# Altium schematic sheet HVPSV3_GaN_system_5_5V_v2.SchDoc
size D; PageSetup: Record=PageOptions|CenterHorizontal=False|CenterVertical=False|PrintScale=0.75|XCorrection=0.75|YCorrection=1.00|PrintKind=0|BorderSize=5000000|LeftOffset=0|BottomOffset=1|Orientation=2|PaperLength=1000|PaperWidth=1000|Scale=100|PaperSource=7|PrintQuality=-3|MediaType=1|DitherType=10|PrintScaleMode=0|PaperKind=Letter|PaperIndex=1
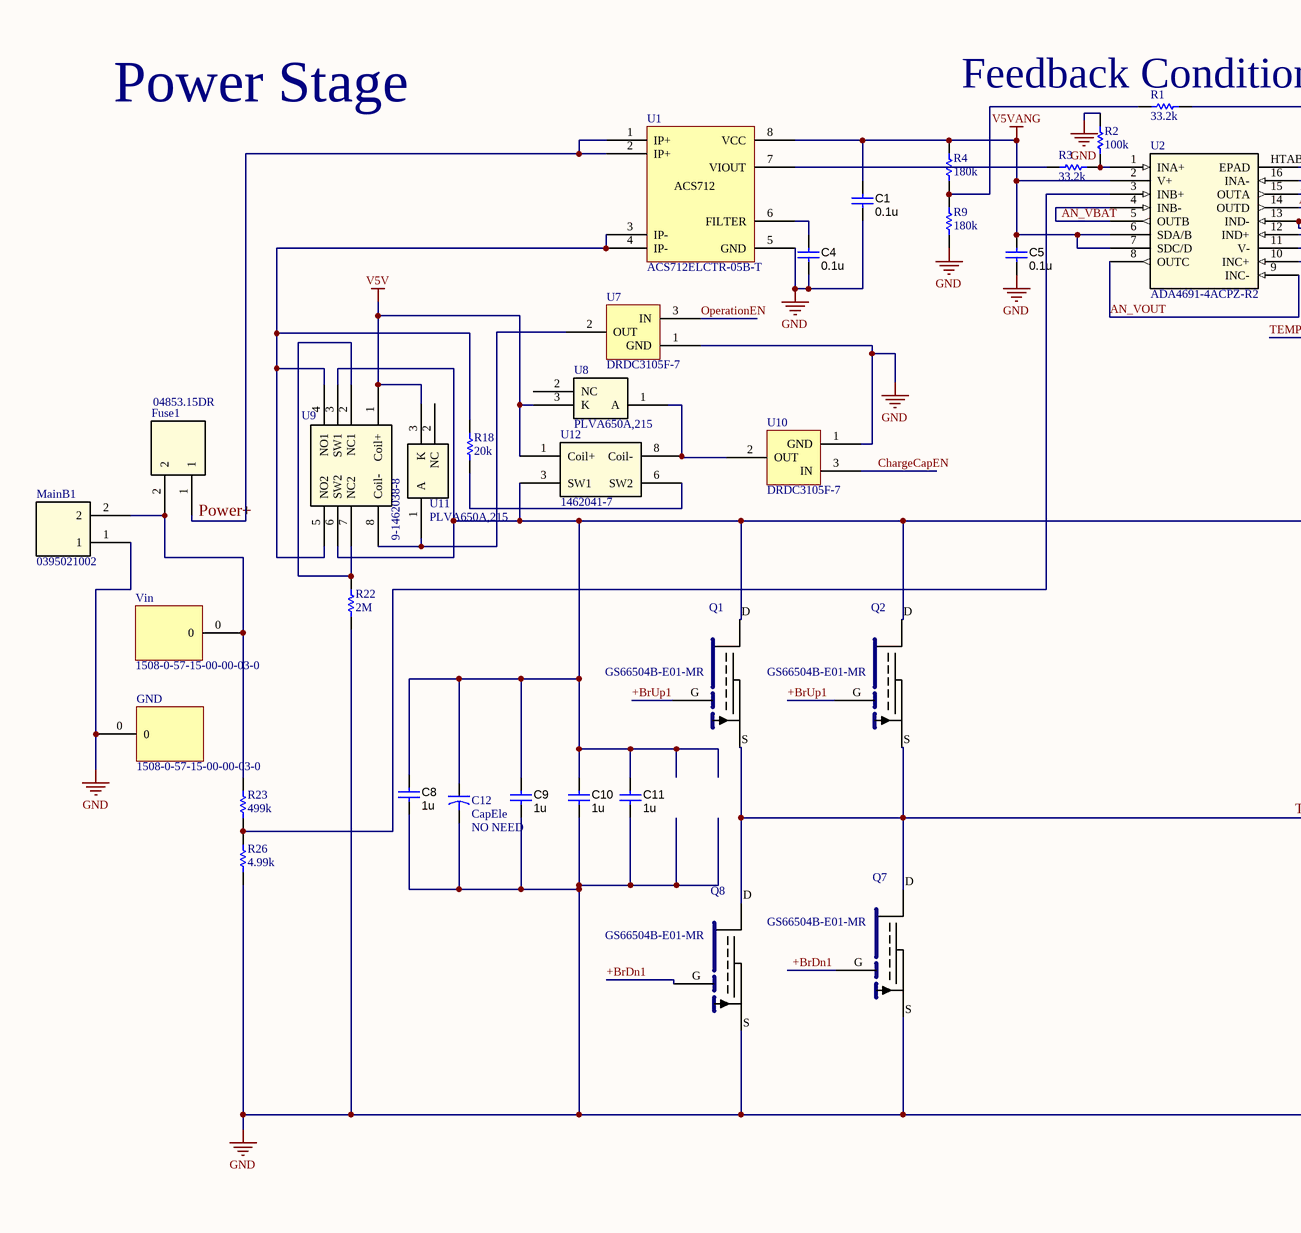
[diagram p0: HVPSV3_GaN_system_5_5V_v2.SchDoc, top left]
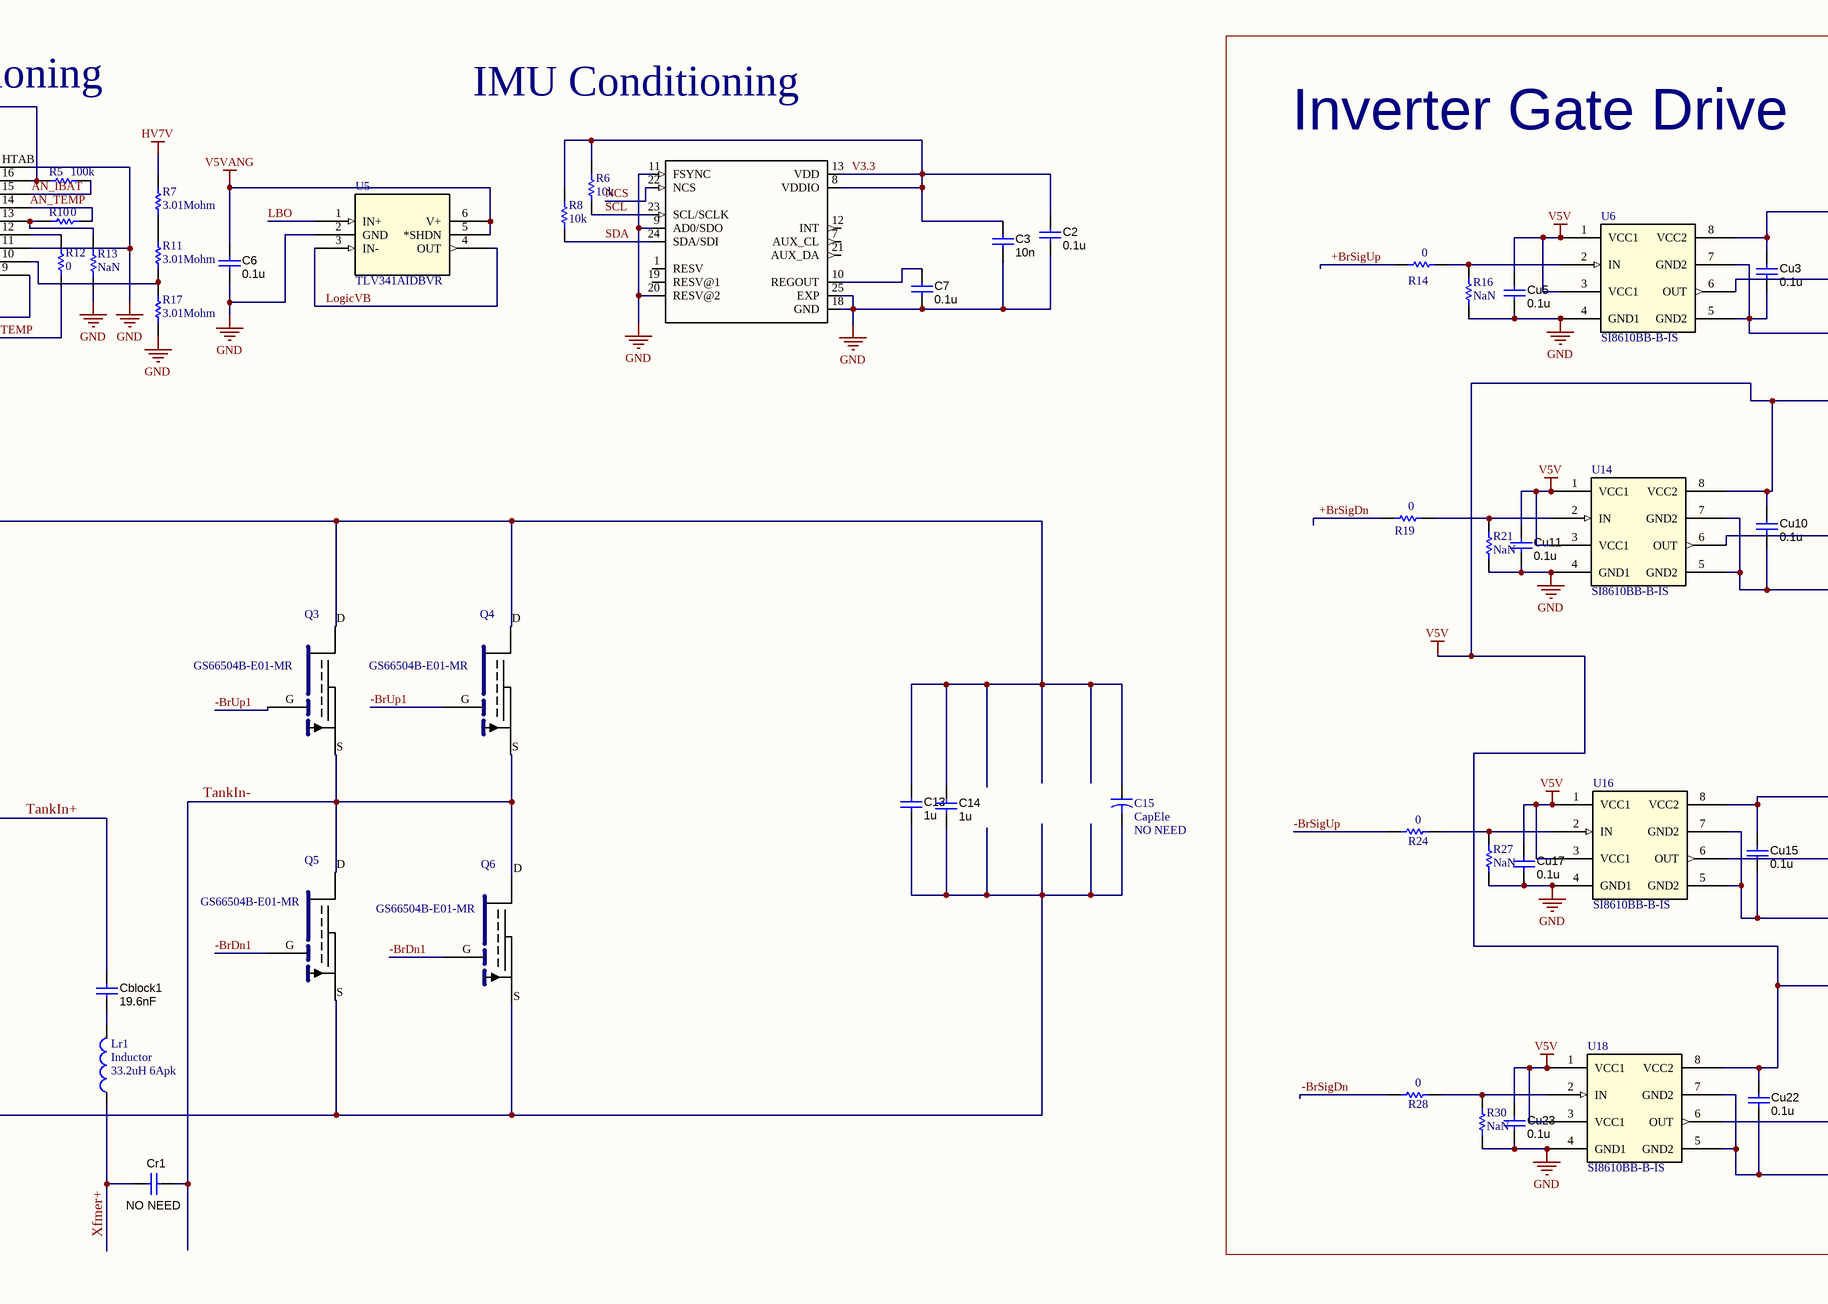
[diagram p1: HVPSV3_GaN_system_5_5V_v2.SchDoc, top middle]
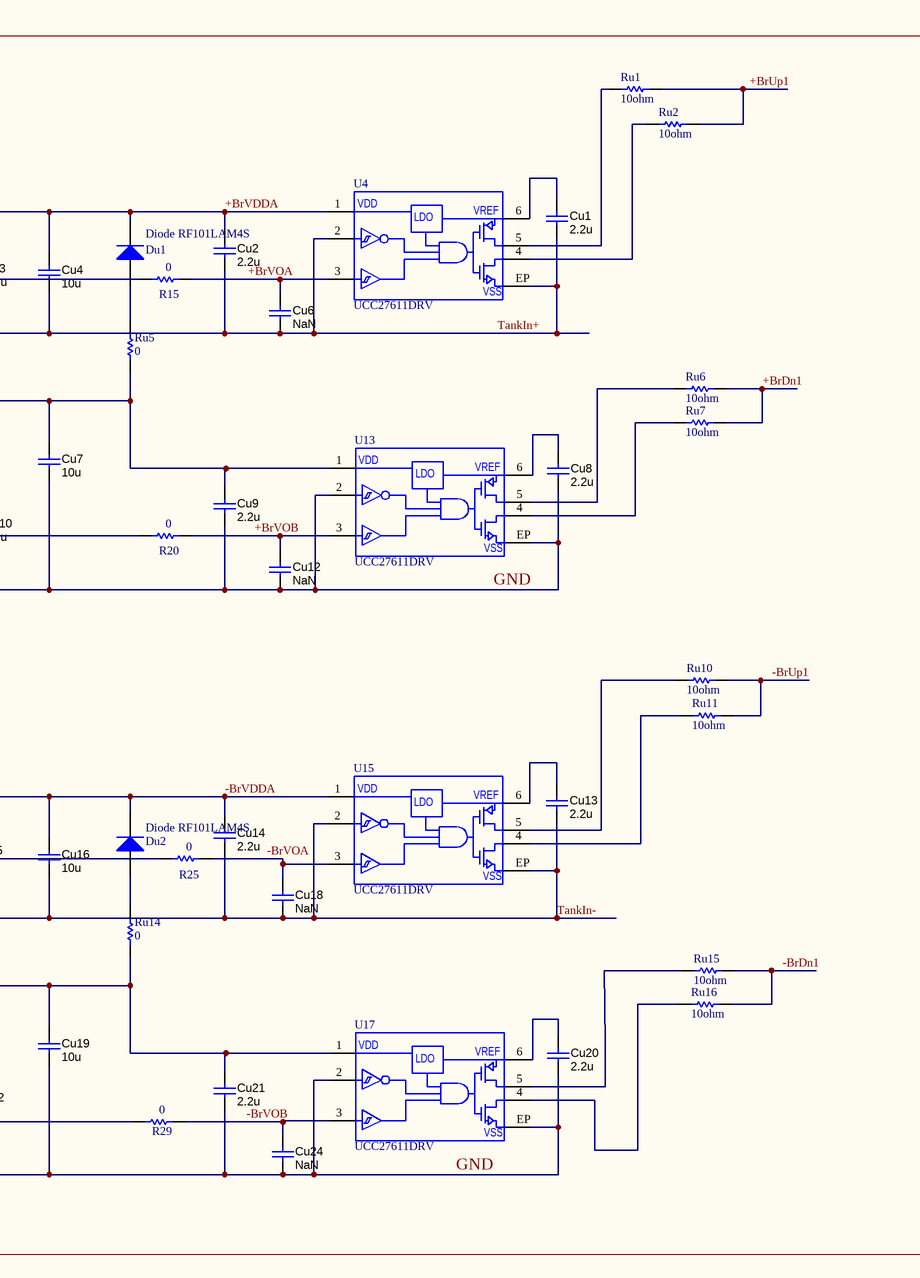
[diagram p2: HVPSV3_GaN_system_5_5V_v2.SchDoc, top right]
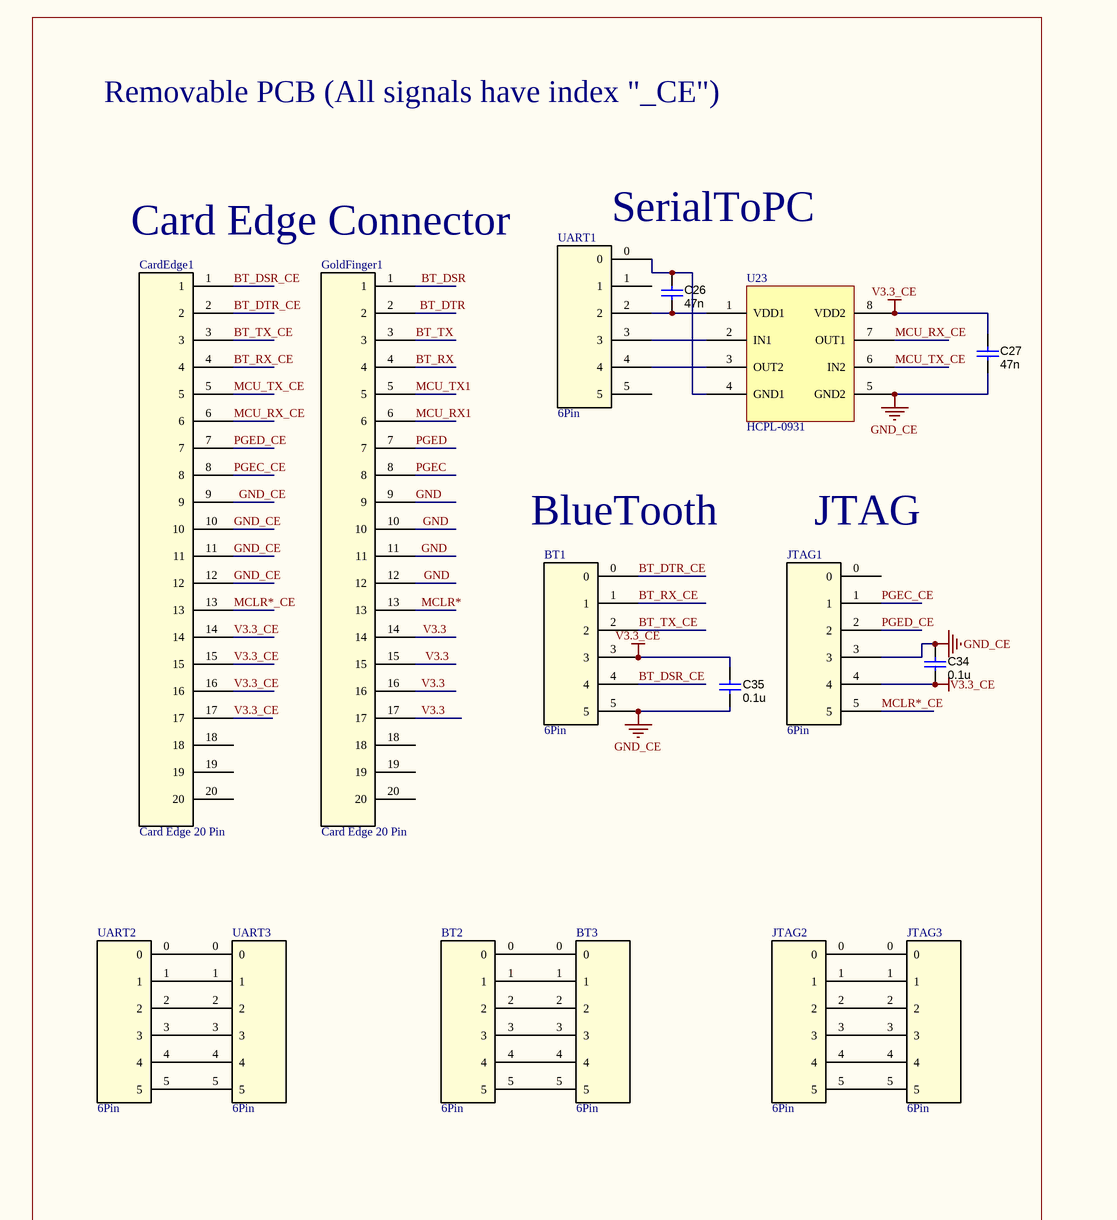
[diagram p3: HVPSV3_GaN_system_5_5V_v2.SchDoc, bottom left]
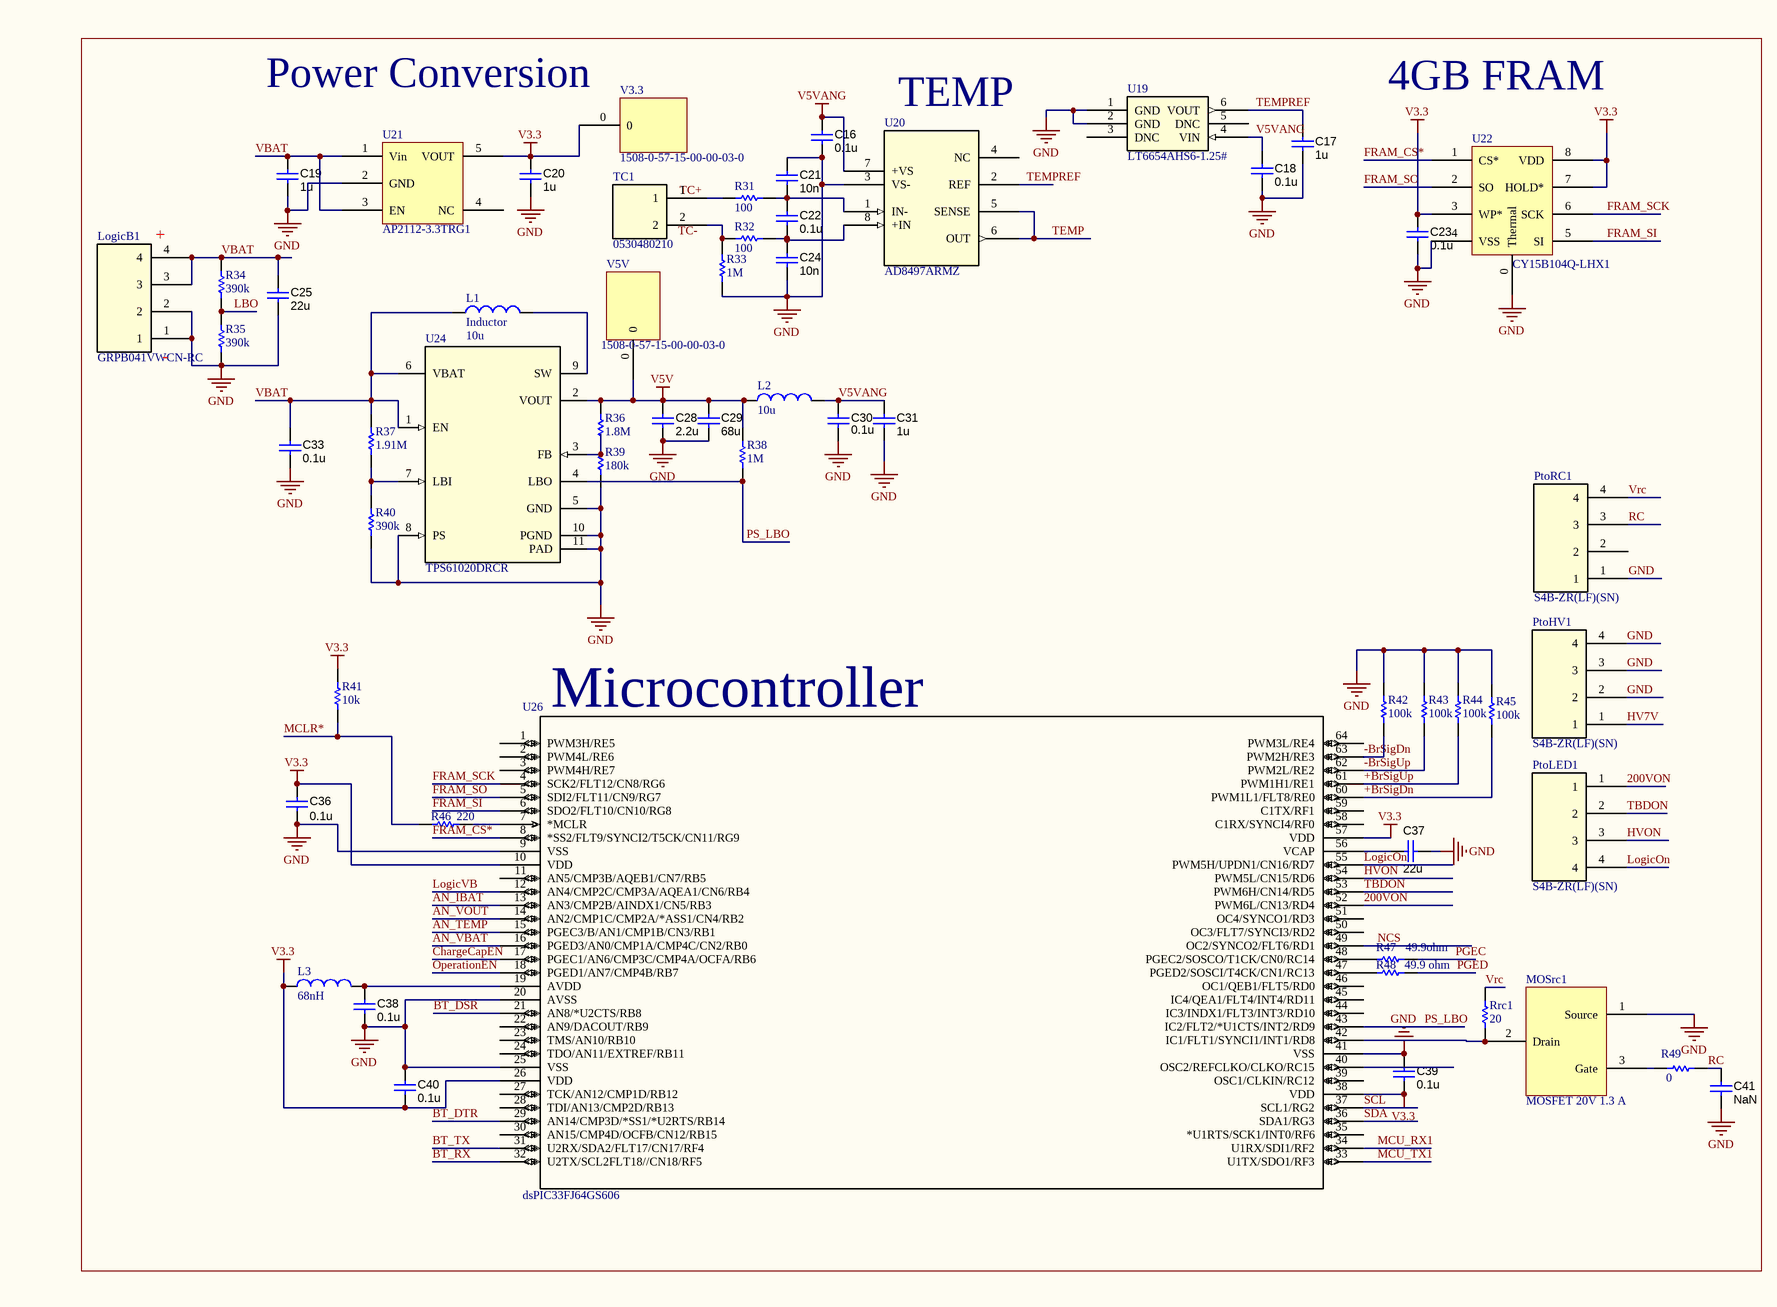
[diagram p4: HVPSV3_GaN_system_5_5V_v2.SchDoc, bottom middle]
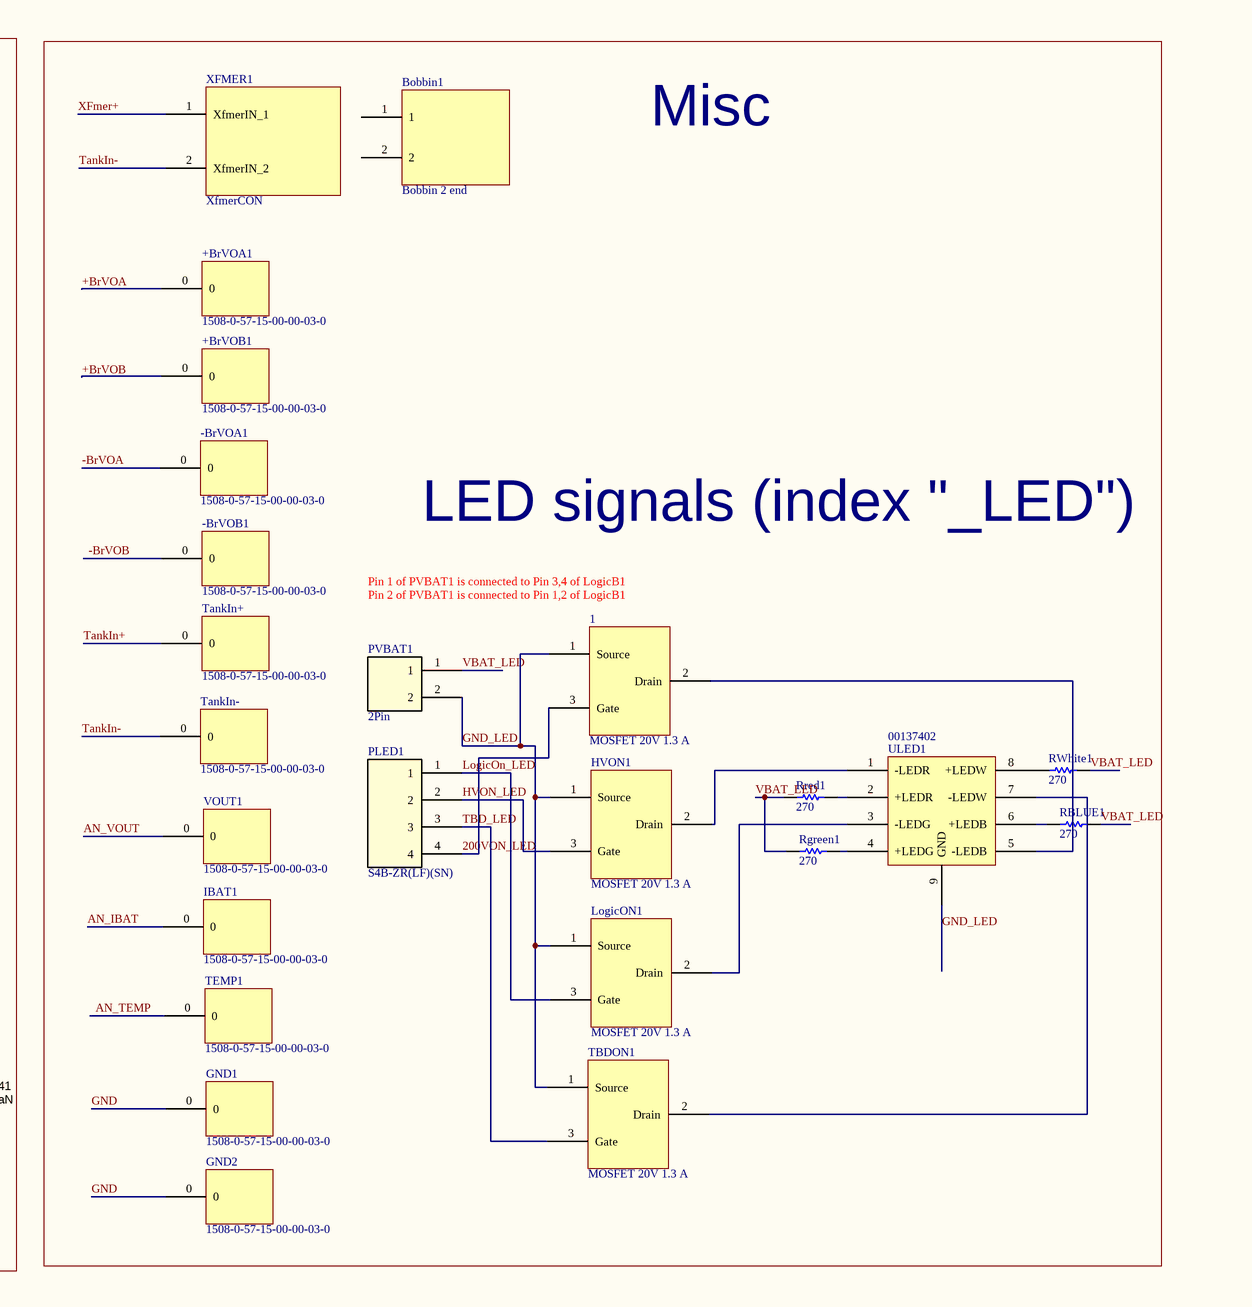
[diagram p5: HVPSV3_GaN_system_5_5V_v2.SchDoc, bottom right]

## Parts
1  MOSFET 20V 1.3 A  [SOT23 Super]
+BrVOA1  1508-0-57-15-00-00-03-0  [TestPoint-MillMaxPin]
+BrVOB1  1508-0-57-15-00-00-03-0  [TestPoint-MillMaxPin]
-BrVOA1  1508-0-57-15-00-00-03-0  [TestPoint-MillMaxPin]
-BrVOB1  1508-0-57-15-00-00-03-0  [TestPoint-MillMaxPin]
Bobbin1  Bobbin 2 end  [RM14 Bobbin - shrink]
BT1  6Pin  [S6B-ZR connector]
BT2  6Pin  [6 pin Terminal - pitch 2.54mm]
BT3  6Pin  [S6B-ZR connector]
C1  0.1u  [C1206]
C2  0.1u  [CAP0402]
C3  10n  [CAP0402]
C4  0.1u  [CAP0603]
C5  0.1u  [C1206]
C6  0.1u  [IND0805]
C7  0.1u  [CAP0402]
C8  1u  [C2220]
C9  1u  [C2220]
C10  1u  [C2220]
C11  1u  [C2220]
C12  CapEle  value NO NEED  [ElecCap - 3.5 mm space]
C13  1u  [C2220]
C14  1u  [C2220]
C15  CapEle  value NO NEED  [ElecCap - 3.5 mm space]
C16  0.1u  [CAP0603]
C17  1u  [CAP0603]
C18  0.1u  [CAP0603]
C19  1u  [CAP0402]
C20  1u  [CAP0402]
C21  10n  [CAP0402]
C22  0.1u  [CAP0402]
C23  0.1u  [IND0805]
C24  10n  [CAP0402]
C25  22u  [C1206]
C26  47n  [C1206]
C27  47n  [C1206]
C28  2.2u  [C1206]
C29  68u  [C1206]
C30  0.1u  [CAP0603]
C31  1u  [CAP0402]
C33  0.1u  [CAP0603]
C34  0.1u  [C1206]
C35  0.1u  [C1206]
C36  0.1u  [C1206]
C37  22u  [C1206]
C38  0.1u  [C1206]
C39  0.1u  [C1206]
C40  0.1u  [C1206]
C41  NaN  [CAP0603]
CardEdge1  Card Edge 20 Pin  [3MCardEdge20Pin_Connector]
Cblock1  19.6nF  [C1210]
Cr1  NO NEED  [C1210]
Cu1  2.2u  [0402]
Cu2  2.2u  [0402]
Cu3  0.1u  [CAP0402]
Cu4  10u  [CAP0603]
Cu5  0.1u  [C1206]
Cu6  NaN  [0402]
Cu7  10u  [CAP0603]
Cu8  2.2u  [0402]
Cu9  2.2u  [0402]
Cu10  0.1u  [C1206]
Cu11  0.1u  [C1206]
Cu12  NaN  [0402]
Cu13  2.2u  [0402]
Cu14  2.2u  [0402]
Cu15  0.1u  [CAP0402]
Cu16  10u  [CAP0603]
Cu17  0.1u  [C1206]
Cu18  NaN  [0402]
Cu19  10u  [CAP0603]
Cu20  2.2u  [0402]
Cu21  2.2u  [0402]
Cu22  0.1u  [C1206]
Cu23  0.1u  [C1206]
Cu24  NaN  [0402]
Du1  Diode RF101LAM4S  [SBR1U400P1]
Du2  Diode RF101LAM4S  [SBR1U400P1]
Fuse1  04853.15DR  [LittleFuse462]
GND  1508-0-57-15-00-00-03-0  [TestPoint-MillMaxPin]
GND1  1508-0-57-15-00-00-03-0  [TestPoint-MillMaxPin]
GND2  1508-0-57-15-00-00-03-0  [TestPoint-MillMaxPin]
GoldFinger1  Card Edge 20 Pin  [3MCardEdge20Pin_Board]
HVON1  MOSFET 20V 1.3 A  [SOT23 Super]
IBAT1  1508-0-57-15-00-00-03-0  [TestPoint-MillMaxPin]
JTAG1  6Pin  [S6B-ZR connector]
JTAG2  6Pin  [6 pin Terminal - pitch 2.54mm]
JTAG3  6Pin  [S6B-ZR connector]
L1  Inductor  value 10u  [SD25inductor]
L2  10u  [IND0805]
L3  68nH  [CAP0603]
LogicB1  GRPB041VWCN-RC  [4 pin Terminal - pitch 1.27mm - right angle]
LogicON1  MOSFET 20V 1.3 A  [SOT23 Super]
Lr1  Inductor  value 33.2uH 6Apk  [ExtInductor]
MainB1  0395021002  [Molex 395001002]
MOSrc1  MOSFET 20V 1.3 A  [SOT23 Super]
PLED1  S4B-ZR(LF)(SN)  [S4B-ZR connector]
PtoHV1  S4B-ZR(LF)(SN)  [S4B-ZR connector]
PtoLED1  S4B-ZR(LF)(SN)  [S4B-ZR connector]
PtoRC1  S4B-ZR(LF)(SN)  [S4B-ZR connector]
PVBAT1  2Pin  [S2B-ZR connector]
Q1  GS66504B-E01-MR  [GS66504B]
Q2  GS66504B-E01-MR  [GS66504B]
Q3  GS66504B-E01-MR  [GS66504B]
Q4  GS66504B-E01-MR  [GS66504B]
Q5  GS66504B-E01-MR  [GS66504B]
Q6  GS66504B-E01-MR  [GS66504B]
Q7  GS66504B-E01-MR  [GS66504B]
Q8  GS66504B-E01-MR  [GS66504B]
R1  value 33.2k  [RES0402]  (hidden comment: Res)
R2  value 100k  [RES0402]  (hidden comment: Res)
R3  value 33.2k  [RES0402]  (hidden comment: Res)
R4  value 180k  [RES0402]  (hidden comment: Res)
R5  value 100k  [RES0402]  (hidden comment: Res)
R6  value 10k  [RES0402]  (hidden comment: Res)
R7  value 3.01Mohm  [C1210]  (hidden comment: Res)
R8  value 10k  [RES0402]  (hidden comment: Res)
R9  value 180k  [RES0402]  (hidden comment: Res)
R10  value 0  [RES0402]  (hidden comment: Res)
R11  value 3.01Mohm  [C1210]  (hidden comment: Res)
R12  value 0  [RES0402]  (hidden comment: Res)
R13  value NaN  [RES0402]  (hidden comment: Res)
R14  value 0  [RES0402]  (hidden comment: Res)
R15  value 0  [RES0402]  (hidden comment: Res)
R16  value NaN  [RES0402]  (hidden comment: Res)
R17  value 3.01Mohm  [C1210]  (hidden comment: Res)
R18  value 20k  [IND0805]  (hidden comment: Res)
R19  value 0  [RES0402]  (hidden comment: Res)
R20  value 0  [RES0402]  (hidden comment: Res)
R21  value NaN  [RES0402]  (hidden comment: Res)
R22  value 2M  [C1210]  (hidden comment: Res)
R23  value 499k  [IND0805]  (hidden comment: Res)
R24  value 0  [RES0402]  (hidden comment: Res)
R25  value 0  [RES0402]  (hidden comment: Res)
R26  value 4.99k  [RES0603]  (hidden comment: Res)
R27  value NaN  [RES0402]  (hidden comment: Res)
R28  value 0  [RES0402]  (hidden comment: Res)
R29  value 0  [RES0402]  (hidden comment: Res)
R30  value NaN  [RES0402]  (hidden comment: Res)
R31  value 100  [RES0402]  (hidden comment: Res)
R32  value 100  [RES0402]  (hidden comment: Res)
R33  value 1M  [RES0402]  (hidden comment: Res)
R34  value 390k  [RES0402]  (hidden comment: Res)
R35  value 390k  [RES0402]  (hidden comment: Res)
R36  value 1.8M  [RES0402]  (hidden comment: Res)
R37  value 1.91M  [RES0402]  (hidden comment: Res)
R38  value 1M  [RES0402]  (hidden comment: Res)
R39  value 180k  [RES0603]  (hidden comment: Res)
R40  value 390k  [RES0402]  (hidden comment: Res)
R41  value 10k  [RES0402]  (hidden comment: Res)
R42  value 100k  [RES0402]  (hidden comment: Res)
R43  value 100k  [RES0402]  (hidden comment: Res)
R44  value 100k  [RES0402]  (hidden comment: Res)
R45  value 100k  [RES0402]  (hidden comment: Res)
R46  value 220  [RES0402]  (hidden comment: Res)
R47  value 49.9ohm  [RES0402]  (hidden comment: Res)
R48  value 49.9 ohm  [RES0402]  (hidden comment: Res)
R49  value 0  [RES0603]  (hidden comment: Res)
RBLUE1  value 270  [RES0603]  (hidden comment: Res)
Rgreen1  value 270  [RES0603]  (hidden comment: Res)
Rrc1  value 20  [RES0603]  (hidden comment: Res)
Rred1  value 270  [RES0603]  (hidden comment: Res)
Ru1  value 10ohm  [0402]  (hidden comment: Res)
Ru2  value 10ohm  [0402]  (hidden comment: Res)
Ru5  value 0  [IND0805]  (hidden comment: Res)
Ru6  value 10ohm  [0402]  (hidden comment: Res)
Ru7  value 10ohm  [0402]  (hidden comment: Res)
Ru10  value 10ohm  [0402]  (hidden comment: Res)
Ru11  value 10ohm  [0402]  (hidden comment: Res)
Ru14  value 0  [IND0805]  (hidden comment: Res)
Ru15  value 10ohm  [0402]  (hidden comment: Res)
Ru16  value 10ohm  [0402]  (hidden comment: Res)
RWhite1  value 270  [RES0603]  (hidden comment: Res)
TankIn+  1508-0-57-15-00-00-03-0  [TestPoint-MillMaxPin]
TankIn-  1508-0-57-15-00-00-03-0  [TestPoint-MillMaxPin]
TBDON1  MOSFET 20V 1.3 A  [SOT23 Super]
TC1  0530480210  [2 pin Terminal - pitch 1.27mm - right angle]
TEMP1  1508-0-57-15-00-00-03-0  [TestPoint-MillMaxPin]
U1  ACS712ELCTR-05B-T  [SOIC-8]
U2  ADA4691-4ACPZ-R2  [CP_16_22]
U3  MPU-9250  [QFN40P300X300X105-25N]  (value not drawn)
U4  UCC27611DRV  [WSON-N6]
U5  TLV341AIDBVR  [DBV6]
U6  SI8610BB-B-IS  [D8]
U7  DRDC3105F-7  [SOT23]
U8  PLVA650A,215  [SOT23 - ZenerDiode]
U9  9-1462038-8  [GullWing8Pin]
U10  DRDC3105F-7  [SOT23]
U11  PLVA650A,215  [SOT23 - ZenerDiode]
U12  1462041-7  [GullWing4Pin]
U13  UCC27611DRV  [WSON-N6]
U14  SI8610BB-B-IS  [D8]
U15  UCC27611DRV  [WSON-N6]
U16  SI8610BB-B-IS  [D8]
U17  UCC27611DRV  [WSON-N6]
U18  SI8610BB-B-IS  [D8]
U19  LT6654AHS6-1.25#  [TSOT-23_S6]
U20  AD8497ARMZ  [RM_8]
U21  AP2112-3.3TRG1  [SOT23-5]
U22  CY15B104Q-LHX1  [DFN-8pin]
U23  HCPL-0931  [SOIC-8]
U24  TPS61020DRCR  [DRC0010A]
U26  dsPIC33FJ64GS606  [TQFP64_10x10MC]
UART1  6Pin  [S6B-ZR connector]
UART2  6Pin  [6 pin Terminal - pitch 2.54mm]
UART3  6Pin  [S6B-ZR connector]
ULED1  00137402  [LED00137402]
V3.3  1508-0-57-15-00-00-03-0  [TestPoint-MillMaxPin]
V5V  1508-0-57-15-00-00-03-0  [TestPoint-MillMaxPin]
Vin  1508-0-57-15-00-00-03-0  [TestPoint-MillMaxPin]
VOUT1  1508-0-57-15-00-00-03-0  [TestPoint-MillMaxPin]
XFMER1  XfmerCON  [ExtInductor]

## Blocks framed on the sheet
Inverter Gate Drive: Cu1-Cu24 Du1 Du2 R14-R16 R19-R21 R24 R25 R27-R30 Ru1 Ru2 Ru5-Ru7 Ru10 Ru11 Ru14-Ru16 U4 U6 U13-U18
Microcontroller: C16-C25 C28-C31 C33 C36-C41 L1-L3 LogicB1 MOSrc1 PtoHV1 PtoLED1 PtoRC1 R31-R49 Rrc1 TC1 U19-U22 U24 U26 V3.3 V5V

## Nets
GND: C1.2 C2.2 C3.2 C4.2 C5.2 C6.2 C7.2 C8.2 C9.2 C10.2 C11.2 C12.2 C13.2 C14.2 C15.2 C16.2 C17.2 C18.2 C19.2 C20.2 C21.1 C23.2 C24.2 C25.2 C28.2 C29.2 C30.2 C31.2 C33.2 C36.2 C37.2 C38.2 C39.1 C40.1 C41.2 Cu5.2 Cu7.2 Cu8.2 Cu9.2 Cu10.2 Cu11.2 Cu12.2 Cu17.2 Cu19.2 Cu20.2 Cu21.2 Cu22.2 Cu23.2 Cu24.2 GND.0 GND1.0 GND2.0 GoldFinger1.9 GoldFinger1.10 GoldFinger1.11 GoldFinger1.12 LogicB1.1 LogicB1.2 MainB1.1 MOSrc1.1(Source) PtoHV1.2 PtoHV1.3 PtoHV1.4 PtoRC1.1 Q5.S Q6.S Q7.S Q8.S R2.2 R9.1 R13.1 R16.1 R17.1 R21.1 R22.1 R26.1 R27.1 R30.1 R33.1 R35.1 R39.1 R40.1 R42.2 R43.2 R44.2 R45.2 U1.5(GND) U2.11(V-) U2.HTAB(EPAD) U3.9(AD0/SDO) U3.11(FSYNC) U3.18(GND) U3.20(RESV@2) U3.25(EXP) U5.2(GND) U6.4(GND1) U7.1(GND) U10.1(GND) U13.2(INB) U13.EP(VSS) U14.4(GND1) U14.5(GND2) U14.7(GND2) U16.4(GND1) U17.2(INB) U17.EP(VSS) U18.4(GND1) U18.5(GND2) U18.7(GND2) U19.1(GND) U19.2(GND) U20.3(VS-) U21.2(GND) U22.0(Thermal) U22.4(VSS) U24.5(GND) U24.8(PS) U24.10(PGND) U24.11(PAD) U26.9(VSS) U26.20(AVSS) U26.25(VSS) U26.41(VSS)
GND_CE: BT1.5 C27.2 C34.1 C35.2 CardEdge1.9 CardEdge1.10 CardEdge1.11 CardEdge1.12 JTAG1.3 U23.5(GND2)
HV7V: PtoHV1.1 R7.2
V3.3: C2.1 C3.1 C20.1 C23.1 C36.1 C39.2 C40.2 GoldFinger1.14 GoldFinger1.15 GoldFinger1.16 GoldFinger1.17 L3.1 R6.2 R8.2 R41.2 U3.8(VDDIO) U3.13(VDD) U21.5(VOUT) U22.3(WP*) U22.7(HOLD*) U22.8(VDD) U26.10(VDD) U26.26(VDD) U26.38(VDD) U26.57(VDD) V3.3.0
V3.3_CE: BT1.3 C27.1 C34.2 C35.1 CardEdge1.14 CardEdge1.15 CardEdge1.16 CardEdge1.17 JTAG1.4 U23.8(VDD2)
V5V: C28.1 C29.1 Cu5.1 Cu7.1 Cu9.1 Cu10.1 Cu11.1 Cu17.1 Cu19.1 Cu21.1 Cu22.1 Cu23.1 L2.1 R36.2 R38.2 Ru5.1 Ru14.1 U6.1(VCC1) U6.3(VCC1) U8.3(K) U9.1(Coil+) U11.3(K) U12.1(Coil+) U13.1(VDD) U14.1(VCC1) U14.3(VCC1) U14.8(VCC2) U16.1(VCC1) U16.3(VCC1) U17.1(VDD) U18.1(VCC1) U18.3(VCC1) U18.8(VCC2) U24.2(VOUT) V5V.0
V5VANG: C1.1 C5.1 C6.1 C16.1 C18.1 C30.1 C31.1 L2.2 R4.2 U1.8(VCC) U2.2(V+) U2.6(SDA/B) U2.7(SDC/D) U5.5(*SHDN) U5.6(V+) U19.4(VIN) U20.7(+VS)
200VON: PtoLED1.1 U26.52(PWM6L/CN13/RD4)
200VON_LED: 1.3(Gate) PLED1.4
+BrDn1: Q7.G Q8.G Ru6.2 Ru7.2
+BrSigDn: R19.1 R45.1 U26.60(PWM1L1/FLT8/RE0)
+BrSigUp: R14.1 R44.1 U26.61(PWM1H1/RE1)
+BrUp1: Q1.G Q2.G Ru1.2 Ru2.2
+BrVDDA: Cu2.1 Cu3.1 Cu4.1 Du1.K U4.1(VDD) U6.8(VCC2)
+BrVOA: +BrVOA1.0 Cu6.1 R15.2 U4.3(IN)
+BrVOB: +BrVOB1.0 Cu12.1 R20.2 U13.3(IN)
-BrDn1: Q5.G Q6.G Ru15.2 Ru16.2
-BrSigDn: R28.1 R42.1 U26.63(PWM2H/RE3)
-BrSigUp: R24.1 R43.1 U26.62(PWM2L/RE2)
-BrUp1: Q3.G Q4.G Ru10.2 Ru11.2
-BrVDDA: Cu14.1 Cu15.1 Cu16.1 Du2.K U15.1(VDD) U16.8(VCC2)
-BrVOA: -BrVOA1.0 Cu18.1 R25.2 U15.3(IN)
-BrVOB: -BrVOB1.0 Cu24.1 R29.2 U17.3(IN)
AN_IBAT: IBAT1.0 R5.2 U2.15(OUTA) U26.13(AN3/CMP2B/AINDX1/CN5/RB3)
AN_TEMP: R10.1 TEMP1.0 U2.14(OUTD) U26.15(PGEC3/B/AN1/CMP1B/CN3/RB1)
AN_VBAT: U2.4(INB-) U2.5(OUTB) U26.16(PGED3/AN0/CMP1A/CMP4C/CN2/RB0)
AN_VOUT: U2.8(OUTC) U2.9(INC-) U26.14(AN2/CMP1C/CMP2A/*ASS1/CN4/RB2) VOUT1.0
BT_DSR: GoldFinger1.1 U26.21(AN8/*U2CTS/RB8)
BT_DSR_CE: BT1.4 CardEdge1.1
BT_DTR: GoldFinger1.2 U26.29(AN14/CMP3D/*SS1/*U2RTS/RB14)
BT_DTR_CE: BT1.0 CardEdge1.2
BT_RX: GoldFinger1.4 U26.32(U2TX/SCL2FLT18//CN18/RF5)
BT_RX_CE: BT1.1 CardEdge1.4
BT_TX: GoldFinger1.3 U26.31(U2RX/SDA2/FLT17/CN17/RF4)
BT_TX_CE: BT1.2 CardEdge1.3
ChargeCapEN: U10.3(IN) U26.17(PGEC1/AN6/CMP3C/CMP4A/OCFA/RB6)
FRAM_CS*: U22.1(CS*) U26.8(*SS2/FLT9/SYNCI2/T5CK/CN11/RG9)
FRAM_SCK: U22.6(SCK) U26.4(SCK2/FLT12/CN8/RG6)
FRAM_SI: U22.5(SI) U26.6(SDO2/FLT10/CN10/RG8)
FRAM_SO: U22.2(SO) U26.5(SDI2/FLT11/CN9/RG7)
GND_LED: 1.1(Source) HVON1.1(Source) LogicON1.1(Source) PVBAT1.2 TBDON1.1(Source) ULED1.9(GND)
HVON: PtoLED1.3 U26.54(PWM5L/CN15/RD6)
HVON_LED: HVON1.3(Gate) PLED1.2
LBO: R34.1 R35.2 U5.1(IN+)
LogicOn: PtoLED1.4 U26.55(PWM5H/UPDN1/CN16/RD7)
LogicOn_LED: LogicON1.3(Gate) PLED1.1
LogicVB: U5.3(IN-) U5.4(OUT) U26.12(AN4/CMP2C/CMP3A/AQEA1/CN6/RB4)
MCLR*: GoldFinger1.13 R41.1 R46.2
MCLR*_CE: CardEdge1.13 JTAG1.5
MCU_RX1: GoldFinger1.6 U26.34(U1RX/SDI1/RF2)
MCU_RX_CE: CardEdge1.6 U23.7(OUT1)
MCU_TX1: GoldFinger1.5 U26.33(U1TX/SDO1/RF3)
MCU_TX_CE: CardEdge1.5 U23.6(IN2)
NCS: U3.22(NCS) U26.49(OC2/SYNCO2/FLT6/RD1)
OperationEN: U7.3(IN) U26.18(PGED1/AN7/CMP4B/RB7)
PGEC: GoldFinger1.8 R47.2
PGEC_CE: CardEdge1.8 JTAG1.1
PGED: GoldFinger1.7 R48.2
PGED_CE: CardEdge1.7 JTAG1.2
Power+: Fuse1.1 U1.1(IP+) U1.2(IP+)
PS_LBO: R38.1 U24.4(LBO) U26.43(IC2/FLT2/*U1CTS/INT2/RD9)
RC: C41.1 PtoRC1.3 R49.1
SCL: R6.1 U3.23(SCL/SCLK) U26.37(SCL1/RG2)
SDA: R8.1 U3.24(SDA/SDI) U26.36(SDA1/RG3)
TankIn+: Cblock1.1 Cu1.2 Cu2.2 Cu3.2 Cu4.2 Cu6.2 Q1.S Q2.S Q7.D Q8.D TankIn+.0 U4.2(INB) U4.EP(VSS) U6.5(GND2) U6.7(GND2)
TankIn-: Cr1.1 Cu13.2 Cu14.2 Cu15.2 Cu16.2 Cu18.2 Q3.S Q4.S Q5.D Q6.D TankIn-.0 U15.2(INB) U15.EP(VSS) U16.5(GND2) U16.7(GND2) XFMER1.2(XfmerIN_2)
TBD_LED: PLED1.3 TBDON1.3(Gate)
TBDON: PtoLED1.2 U26.53(PWM6H/CN14/RD5)
TEMP: R12.2 U20.5(SENSE) U20.6(OUT)
TEMPREF: C17.1 U19.6(VOUT) U20.2(REF)
VBAT: C19.1 C25.1 C33.1 L1.1 LogicB1.3 LogicB1.4 R34.2 R37.2 U21.1(Vin) U21.3(EN) U24.1(EN) U24.6(VBAT)
VBAT_LED: PVBAT1.1 RBLUE1.2 Rgreen1.1 Rred1.1 RWhite1.2
Vrc: PtoRC1.4 Rrc1.2
XFmer+: Cr1.2 Lr1.1 XFMER1.1(XfmerIN_1)
Net1_2: 1.2(Drain) ULED1.5(-LEDB)
NetBT2_0: BT2.0 BT3.0
NetBT2_1: BT2.1 BT3.1
NetBT2_2: BT2.2 BT3.2
NetBT2_3: BT2.3 BT3.3
NetBT2_4: BT2.4 BT3.4
NetBT2_5: BT2.5 BT3.5
NetC4_1: C4.1 U1.6(FILTER)
NetC7_1: C7.1 U3.10(REGOUT)
NetC8_1: C8.1 C9.1 C10.1 C11.1 C12.1 C13.1 C14.1 C15.1 Q1.D Q2.D Q3.D Q4.D U9.3(SW1) U9.6(SW2) U12.3(SW1)
NetC21_2: C21.2 C22.1 R31.2 U20.1(IN-)
NetC22_2: C22.2 C24.1 R32.2 U20.8(+IN)
NetC26_1: C26.1 U23.4(GND1) UART1.0
NetC26_2: C26.2 U23.1(VDD1) UART1.2
NetC37_1: C37.1 U26.56(VCAP)
NetC38_1: C38.1 L3.2 U26.19(AVDD)
NetCblock1_2: Cblock1.2 Lr1.2
NetCu1_1: Cu1.1 U4.6(VREF)
NetCu8_1: Cu8.1 U13.6(VREF)
NetCu13_1: Cu13.1 U15.6(VREF)
NetCu20_1: Cu20.1 U17.6(VREF)
NetDu1_A: Du1.A Ru5.2
NetDu2_A: Du2.A Ru14.2
NetFuse1_2: Fuse1.2 MainB1.2 R23.2 Vin.0
NetHVON1_2: HVON1.2(Drain) ULED1.1(-LEDR)
NetJTAG2_0: JTAG2.0 JTAG3.0
NetJTAG2_1: JTAG2.1 JTAG3.1
NetJTAG2_2: JTAG2.2 JTAG3.2
NetJTAG2_3: JTAG2.3 JTAG3.3
NetJTAG2_4: JTAG2.4 JTAG3.4
NetJTAG2_5: JTAG2.5 JTAG3.5
NetL1_2: L1.2 U24.9(SW)
NetLogicON1_2: LogicON1.2(Drain) ULED1.3(-LEDG)
NetMOSrc1_2: MOSrc1.2(Drain) Rrc1.1 U26.42(IC1/FLT1/SYNCI1/INT1/RD8)
NetMOSrc1_3: MOSrc1.3(Gate) R49.2
NetR1_1: R1.1 R4.1 R9.2
NetR1_2: R1.2 R5.1 U2.16(INA-)
NetR2_1: R2.1 R3.2 U2.1(INA+)
NetR3_1: R3.1 U1.7(VIOUT)
NetR7_1: R7.1 R11.2
NetR10_2: R10.2 R13.2 U2.13(IND-)
NetR11_1: R11.1 R17.2 U2.10(INC+)
NetR12_1: R12.1 U2.12(IND+)
NetR14_2: R14.2 R16.2 U6.2(IN)
NetR15_1: R15.1 U6.6(OUT)
NetR18_1: R18.1 U12.6(SW2)
NetR18_2: R18.2 U1.3(IP-) U1.4(IP-) U9.4(NO1) U9.5(NO2)
NetR19_2: R19.2 R21.2 U14.2(IN)
NetR20_1: R20.1 U14.6(OUT)
NetR22_2: R22.2 U9.2(NC1) U9.7(NC2)
NetR23_1: R23.1 R26.2 U2.3(INB+)
NetR24_2: R24.2 R27.2 U16.2(IN)
NetR25_1: R25.1 U16.6(OUT)
NetR28_2: R28.2 R30.2 U18.2(IN)
NetR29_1: R29.1 U18.6(OUT)
NetR31_1: R31.1 TC1.1
NetR32_1: R32.1 R33.2 TC1.2
NetR36_1: R36.1 R39.2 U24.3(FB)
NetR37_1: R37.1 R40.2 U24.7(LBI)
NetR46_1: R46.1 U26.7(*MCLR)
NetR47_1: R47.1 U26.48(PGEC2/SOSCO/T1CK/CN0/RC14)
NetR48_1: R48.1 U26.47(PGED2/SOSCI/T4CK/CN1/RC13)
NetRBLUE1_1: RBLUE1.1 ULED1.6(+LEDB)
NetRgreen1_2: Rgreen1.2 ULED1.4(+LEDG)
NetRred1_2: Rred1.2 ULED1.2(+LEDR)
NetRu1_1: Ru1.1 U4.5(Pout)
NetRu2_1: Ru2.1 U4.4(Nout)
NetRu6_1: Ru6.1 U13.5(Pout)
NetRu7_1: Ru7.1 U13.4(Nout)
NetRu10_1: Ru10.1 U15.5(Pout)
NetRu11_1: Ru11.1 U15.4(Nout)
NetRu15_1: Ru15.1 U17.5(Pout)
NetRu16_1: Ru16.1 U17.4(Nout)
NetRWhite1_1: RWhite1.1 ULED1.8(+LEDW)
NetTBDON1_2: TBDON1.2(Drain) ULED1.7(-LEDW)
NetU7_2: U7.2(OUT) U9.8(Coil-) U11.1(A)
NetU8_1: U8.1(A) U10.2(OUT) U12.8(Coil-)
NetU23_2: U23.2(IN1) UART1.3
NetU23_3: U23.3(OUT2) UART1.4
NetUART2_0: UART2.0 UART3.0
NetUART2_1: UART2.1 UART3.1
NetUART2_2: UART2.2 UART3.2
NetUART2_3: UART2.3 UART3.3
NetUART2_4: UART2.4 UART3.4
NetUART2_5: UART2.5 UART3.5

Not connected (* = marked no-connect by the designer): Bobbin1 1 2; CardEdge1 18 19 20; GoldFinger1 18 19 20; JTAG1 0; PtoRC1 2; U3 1(RESV) 7(AUX_CL) 12(INT) 19(RESV@1) 21(AUX_DA); U8 2(NC); U11 2(NC); U19 3(DNC) 5(DNC); U20 4(NC); U21 4(NC); U26 1(PWM3H/RE5) 2(PWM4L/RE6) 3(PWM4H/RE7) 11(AN5/CMP3B/AQEB1/CN7/RB5) 22(AN9/DACOUT/RB9) 23(TMS/AN10/RB10) 24(TDO/AN11/EXTREF/RB11) 27(TCK/AN12/CMP1D/RB12) 28(TDI/AN13/CMP2D/RB13) 30(AN15/CMP4D/OCFB/CN12/RB15) 35(*U1RTS/SCK1/INT0/RF6) 39(OSC1/CLKIN/RC12) 40(OSC2/REFCLKO/CLKO/RC15) 44(IC3/INDX1/FLT3/INT3/RD10) 45(IC4/QEA1/FLT4/INT4/RD11) 46(OC1/QEB1/FLT5/RD0) 50(OC3/FLT7/SYNCI3/RD2) 51(OC4/SYNCO1/RD3) 58(C1RX/SYNCI4/RF0) 59(C1TX/RF1) 64(PWM3L/RE4); UART1 1 5

## Notes on the sheet
- Power Stage
- (near R1) Feedback Conditioning
- IMU Conditioning
- Removable PCB (All signals have index "_CE")
- (near V3.3) Power Conversion
- (near U20) TEMP
- 4GB FRAM
- Misc
- Card Edge Connector
- (near UART1) SerialToPC
- (near LogicB1) +
- (near LogicB1) -
- LED signals (index "_LED")
- (near BT1) BlueTooth
- (near JTAG1) JTAG
- Pin 1 of PVBAT1 is connected to Pin 3,4 of LogicB1
- Pin 2 of PVBAT1 is connected to Pin 1,2 of LogicB1
- Labels drawn without touching a wire or pin: TC+, TC-
- (in symbol UCC27611DRV) LDO

## Library data of the parts
1 HVON1 LogicON1 MOSrc1 TBDON1 = NDS331N: Component Link: https://www.fairchildsemi.com/datasheets/ND/NDS331N.pdf
+BrVOA1 +BrVOB1 -BrVOA1 -BrVOB1 GND GND1 GND2 IBAT1 TankIn+ TankIn- TEMP1 V3.3 V5V Vin VOUT1 = TestPinSingle
Bobbin1 = Bobbin
BT1-BT3 JTAG1-JTAG3 UART1-UART3 = 6 pin Terminal: ComponentLink1: http://www.digikey.com/product-detail/en/te-connectivity-amp-connectors/3-644456-6/A31116-ND/698348
C1 C5 C25-C29 C34-C40 Cu5 Cu10 Cu11 Cu17 Cu22 Cu23 = Cap_1206: CAP, CERM, 1206; Polarized: N; CompType: Capacitor; U/M: EA; Cap_Case: 1206; SymbolVersion: 2015-08-22; RoHS: Y; MountType: SMT; Published: 2015-08-22; Publisher: YiouHe
  C1 C5 C26-C29 C34-C40 Cu5 Cu10 Cu11 Cu17 Cu22 Cu23: Value: =Value
  C25: Value: 22u
C2 C3 C7 C19-C22 C24 C31 Cu3 Cu15 = Cap_0402: CAP, CERM, 0402; Polarized: N; CompType: Capacitor; U/M: EA; Cap_Case: 0603; SymbolVersion: 2015-08-22; RoHS: Y; MountType: SMT; Published: 2015-08-22; Publisher: YiouHe; Value: =Value
C4 C16-C18 C30 C33 C41 = Cap_0603: CAP, CERM, 0603; Polarized: N; CompType: Capacitor; U/M: EA; Cap_Case: 0603; SymbolVersion: 2015-08-22; RoHS: Y; MountType: SMT; Published: 2015-08-22; Publisher: YiouHe; Value: =Value
C6 C23 = Cap_0805: CAP, CERM, 0805; Polarized: N; CompType: Capacitor; U/M: EA; Cap_Case: 0805; SymbolVersion: 2015-08-22; RoHS: Y; MountType: SMT; Published: 2015-08-22; Publisher: YiouHe; Value: =Value
C8-C11 C13 C14 = Cap_2220: CAP, CERM, 2220; Polarized: N; CompType: Capacitor; U/M: EA; Cap_Case: 2220; SymbolVersion: 2015-08-22; RoHS: Y; MountType: SMT; Published: 2015-08-22; Publisher: YiouHe; Value: =Value
C12 C15 = CapEle: Capacitor; Published: 23-Sep-2002; PackageReference: CAPR5-4X5; Publisher: Altium Limited; PackageDescription: Capacitor; 2 Leads
CardEdge1 GoldFinger1 = CardEdge20Pin: 3M 20 pin card edge, SPD08-020-RB-TR; ComponentLink: https://www.digikey.com/products/en?keywords=3M10682CT-ND
Cblock1 Cr1 = Cap_1206_1210: CAP, CERM, 1206 or 1210; Polarized: N; CompType: Capacitor; U/M: EA; Cap_Case: 1210; SymbolVersion: 2015-08-22; RoHS: Y; MountType: SMT; Published: 2015-08-22; Publisher: YiouHe; Value: =Value
Cu1 Cu2 Cu6 Cu8 Cu9 Cu12-Cu14 Cu18 Cu20 Cu21 Cu24 = Cap_0402: CAP, CERM, 0402; Polarized: N; CompType: Capacitor; U/M: EA; SymbolVersion: 2015-08-22; RoHS: Y; MountType: SMT; Cap_Case: 0402; Published: 2015-08-22; Publisher: YiouHe; Value: =Value
Cu4 Cu7 Cu16 Cu19 = Cap_0603_0805: 0603 or 0805; Polarized: N; CompType: Capacitor; U/M: EA; Cap_Case: 0603; SymbolVersion: 2015-08-22; RoHS: Y; MountType: SMT; Published: 2015-08-22; Publisher: YiouHe; Value: =Value
Du1 Du2 = Diode SBR1U400P1: SBR1U400P1; Published: 8-Sept-2015; PackageReference: 2106; Publisher: Altium Limited; PackageDescription: Diode, pad 5.49x1.67 mm (LxW. max); ComponentLink1Description: Manufacturer Link; ComponentLink1URL: http://www.digikey.com/product-detail/en/ES1D/ES1DFSCT-ND/458940
Fuse1 = Fuse: ComponentLink1: http://www.digikey.com/scripts/DkSearch/dksus.dll?Detail&itemSeq=195945201&uq=635977101282764137
L1 Lr1 = Inductor: ResonantInd; Code_IEC: 1005; Published: 8-Jun-2000; LatestRevisionDate: 29-May-2009; LatestRevisionNote: IPC-7351 Footprint Added.; PackageReference: 0402-A; Publisher: Altium Limited; PackageDescription: Chip Inductor; Code_JEITA: 0402
L2 = L0805: Chip Inductor; Value: =Value
L3 = L0603: Chip Inductor; Value: =Value
LogicB1 PLED1 PtoHV1 PtoLED1 PtoRC1 = 4 pin Terminal: ComponentLink1: http://www.digikey.com/product-detail/en/te-connectivity-amp-connectors/3-644456-6/A31116-ND/698348
MainB1 PVBAT1 TC1 = 2 pin Terminal: ComponentLink1: http://www.digikey.com/scripts/DkSearch/dksus.dll?Detail&itemSeq=195945201&uq=635977101282764137
Q1-Q8 = GS66504B: GAN TRANS E-MODE 650V
R1-R49 RBLUE1 Rgreen1 Rrc1 Rred1 Ru1 Ru2 Ru5-Ru7 Ru10 Ru11 Ru14-Ru16 RWhite1 = Res: Resistor; Published: 8-Sept-2015; LatestRevisionNote: Re-released for DXP Platform.; Publisher: Altium Limited; PackageDescription: SMD resistor
  R1-R6 R8-R10 R12 R13: PackageReference: 0402
  R7 R11 R14-R49 RBLUE1 Rgreen1 Rrc1 Rred1 Ru1 Ru2 Ru5-Ru7 Ru10 Ru11 Ru14-Ru16 RWhite1: PackageReference: 0603
U1 = ACS712: Hall Sensor IC (6 x 5mm); SubFamily: Hall effect current sensor; Bandwidth: 80 kHz; Vin (V): 5 V; ComponentLink1URL: http://www.allegromicro.com/en/Products/Current-Sensor-ICs/Zero-To-Fifty-Amp-Integrated-Conductor-Sensor-ICs/ACS712.aspx; ComponentLink1Description: Manufacurer link; Package: SOIC8; ComponentLink2URL: http://www.digikey.com/product-detail/en/allegro-microsystems-llc/ACS712ELCTR-05B-T/620-1189-1-ND/1284606; ComponentLink2Description: Digikey
U2 = ADA4691-4ACPZ-R2: Imported; Vendor: ANALOG; C: Copyright (C) 2015 Accelerated Designs. All rights reserved; Manufacturer_Part_Number: ada4691-4acpz-r2; Copyright: Copyright (C) 2015 Accelerated Designs. All rights reserved; RefDes: RefDes; Type: Type; Value: Value
U3 = MPU-9250: SMD Gyroscope/Accelerometer/Magnetometer Sensor; 9-AXIS; MF: InvenSense; Price: 7.52 USD; MP: MPU-9250; Package: QFN-24 InvenSense; Availability: Good; Value: *
U4 U13 U15 U17 = UCC27611DRV: eGaN Gate Driver with LDO; MFG: Texas Instruments; PCBfootprint: WSON-6; MFGPN: UCC27611DRV; Value: *; Config: *
U5 = TLV341_DBV_6: Imported; GENERIC_PART_NUMBER: TLV341; Vendor: Texas Instruments; PACKAGE_DESIGNATOR: DBV; PIN_COUNT: 6; FAMILY_NAME: STANDARD LINEAR AMPLIFIER; INDUSTRY_STD_PKG_TYPE: SOT-23; Manufacturer_Part_Number: tlv341_dbv_6; Datasheet URL: http://www.ti.com/lit/gpn/TLV341; Manufacturer: Texas Instruments; RefDes: RefDes; Type: Type; Value: Value
U6 U14 U16 U18 = ISO721_D_8: Imported; Manufacturer: Texas Instruments; GENERIC_PART_NUMBER: ISO721; INDUSTRY_STD_PKG_TYPE: SOIC; FAMILY_NAME: ISOLATOR; PIN_COUNT: 8; PACKAGE_DESIGNATOR: D; Datasheet URL: http://www.ti.com/lit/gpn/ISO721; Vendor: Texas Instruments; Manufacturer_Part_Number: iso721_d_8; RefDes: RefDes; Type: Type; Value: Value
U7 U10 = DRDC3105, Relay driver: ComponentLink: http://www.digikey.com/product-detail/en/diodes-incorporated/DRDC3105F-7/DRDC3105F-7DICT-ND/3028441
U8 U11 = PLVA650A: Zener Diode 5V; Vendor: NXP; C: Copyright (C) 2015 Accelerated Designs. All rights reserved; Manufacturer_Part_Number: plva650a; Copyright: Copyright (C) 2015 Accelerated Designs. All rights reserved; RefDes: RefDes; Type: Type; Value: Value
U9 = Relay PB1171CT-ND: Relay PB1171CT-ND 5A
U12 = Relay PB1247CT-ND: Relay PB1247CT-ND 2A
U19 = LT6654AHS6-1.25#: Imported; Manufacturer_Part_Number: lt6654ahs6-1.25#trmpbf; Vendor: Linear Technology; Value: Value; Type: Type; RefDes: RefDes
U20 = AD8497ARMZ: Imported; RefDes: RefDes; Type: Type; Value: Value
U21 = AP2112: AP2112, LDO; ComponentLink: http://www.digikey.com/scripts/DkSearch/dksus.dll?Detail&itemSeq=196056318&uq=635977843130932286
U22 = CY15B104Q: CY15B104Q, Cypress, 4MB, F-Ram
U24 = TPS61020DRCR: Adjustable PS; Manufacturer: Texas Instruments; CompType: IC; PIN_COUNT: 11; PartNumber: TPS61020DRC; PackageReference: DRC0010A; MountType: SMT; RoHS: Y; RefDes: RefDes; Type: TYPE; Value: Value
U26 = dsPIC33FJ64GS606: MicroChip High Speed PWM MCU; SubFamily: Microcontroller; Vin (V): 3 - 3.6 V; ComponentLink1URL: http://www.digikey.com/product-detail/en/microchip-technology/DSPIC33FJ64GS610-50I%2FPF/DSPIC33FJ64GS610-50I%2FPF-ND/3046584; ComponentLink1Description: Digikey link; ComponentLink2URL: http://ww1.microchip.com/downloads/en/DeviceDoc/70000591f.pdf; ComponentLink2Description: Datasheet; DatasheetVersion: DS7000591F; Package: 64-pin TQFN, Body 10x10 mm, pitch 0.5 BSC; Manufacturer: Microchip; PartNumber: dsPIC33FJ64GS606
ULED1 = LED light 00137402: Multi color LED; Componentlink: http://www.osram-os.com/Graphics/XPic7/00137402_0.pdf
U23 = HCPL-0931: ComponentLink: http://www.digikey.com/product-detail/en/broadcom-limited/HCPL-0931/516-2702-5-ND/969355